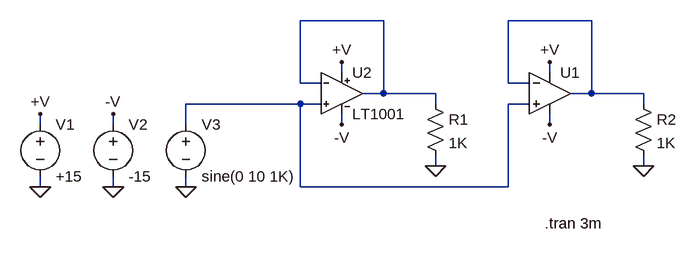
[diagram p0: schematic Boyle.asc]
Boyle.asc, the LTspice schematic file:
Version 4
SHEET 1 1128 680
WIRE 464 112 336 112
WIRE 784 112 656 112
WIRE 400 192 400 176
WIRE 720 192 720 176
WIRE 336 208 336 112
WIRE 368 208 336 208
WIRE 656 208 656 112
WIRE 688 208 656 208
WIRE 464 224 464 112
WIRE 464 224 432 224
WIRE 544 224 464 224
WIRE 784 224 784 112
WIRE 784 224 752 224
WIRE 864 224 784 224
WIRE 336 240 160 240
WIRE 368 240 336 240
WIRE 544 240 544 224
WIRE 688 240 656 240
WIRE 864 240 864 224
WIRE -64 272 -64 256
WIRE 48 272 48 256
WIRE 160 272 160 240
WIRE 400 272 400 256
WIRE 720 272 720 256
WIRE 544 336 544 320
WIRE 864 336 864 320
WIRE -64 368 -64 352
WIRE 48 368 48 352
WIRE 160 368 160 352
WIRE 336 368 336 240
WIRE 656 368 656 240
WIRE 656 368 336 368
FLAG 400 176 +V
FLAG 400 272 -V
FLAG 48 368 0
FLAG -64 368 0
FLAG -64 256 +V
FLAG 48 256 -V
FLAG 160 368 0
FLAG 544 336 0
FLAG 720 176 +V
FLAG 720 272 -V
FLAG 864 336 0
SYMBOL voltage -64 256 R0
SYMATTR InstName V1
SYMATTR Value +15
SYMBOL voltage 48 256 R0
SYMATTR InstName V2
SYMATTR Value -15
SYMBOL voltage 160 256 R0
SYMATTR InstName V3
SYMATTR Value sine(0 10 1K)
SYMBOL res 528 224 R0
SYMATTR InstName R1
SYMATTR Value 1K
SYMBOL res 848 224 R0
SYMATTR InstName R2
SYMATTR Value 1K
SYMBOL opamps\\UniversalOpamp2 720 224 R0
SYMATTR InstName U1
SYMATTR Value2 Avol=800K GBW=.8Meg Slew=.25Meg
SYMATTR SpiceLine2 en=10n enk=4 in=.1p ink=70 Rin=500Meg
SYMBOL LT1001_Boyle 400 160 R0
SYMATTR InstName U2
TEXT 712 424 Left 0 !.tran 3m

The netlist it stands for:
* Boyle.asc
V1 +V 0 +15
V2 -V 0 -15
V3 N003 0 sine(0 10 1K)
R1 N001 0 1K
R2 N002 0 1K
XU1 N003 N002 +V -V N002 level.2 Avol=800K GBW=.8Meg Slew=.25Meg ilimit=25m rail=0 Vos=0 phimargin=45 en=10n enk=4 in=.1p ink=70 Rin=500Meg  ; pins IN+ IN- V+ V- OUT
XU2 N003 N001 +V -V N001 LT1001.boyle LT1001 LT1001.boyle  ; pins In+ In- V+ V- OUT
.tran 3m
.lib UniversalOpamps2.sub
.backanno
.end